# EAGLE design Macro Keyboard 32u4 RC SK6812_LED Ver2.1 (EAGLE 9.6.2)
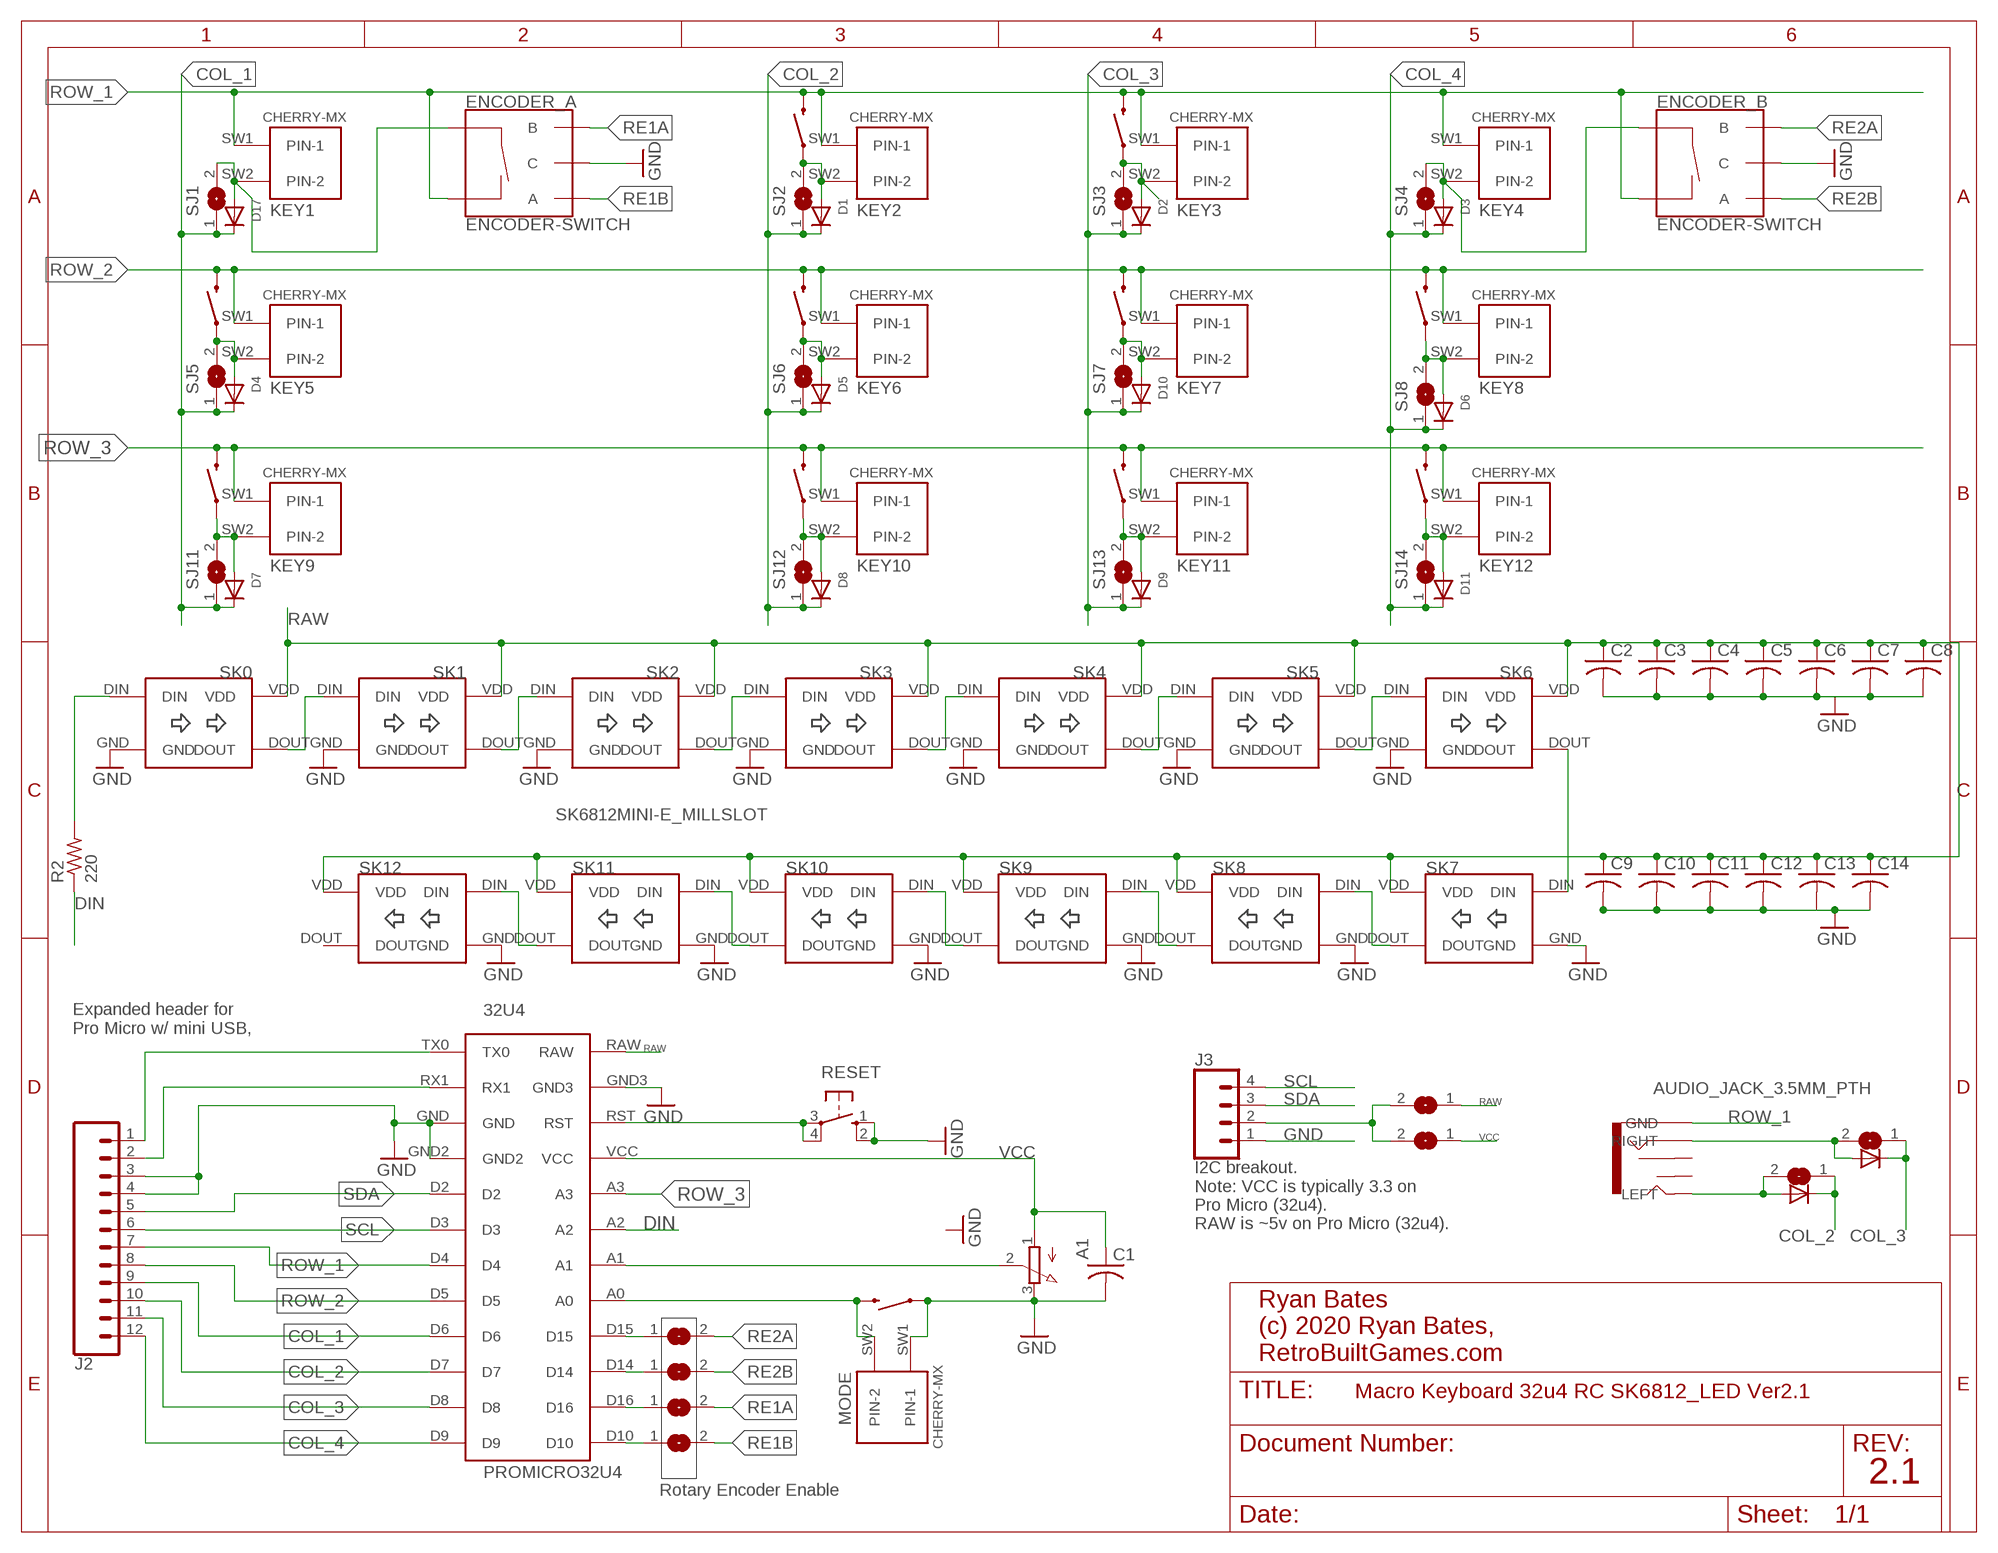
[diagram p0: schematic, sheet 1]

## Parts
32U4  PROMICRO32U4  [PROMICRO32U4]
A1  3RP/1610N  [3RP/1610N]
C1  C-USC1206  [C1206]
C2  C-USC0805K  [C0805K]
C3  C-USC0805K  [C0805K]
C4  C-USC0805K  [C0805K]
C5  C-USC0805K  [C0805K]
C6  C-USC0805K  [C0805K]
C7  C-USC0805K  [C0805K]
C8  C-USC0805K  [C0805K]
C9  C-USC0805K  [C0805K]
C10  C-USC0805K  [C0805K]
C11  C-USC0805K  [C0805K]
C12  C-USC0805K  [C0805K]
C13  C-USC0805K  [C0805K]
C14  C-USC0805K  [C0805K]
D1  DIODESOD-123  [SOD-123]
D2  DIODESOD-123  [SOD-123]
D3  DIODESOD-123  [SOD-123]
D4  DIODESOD-123  [SOD-123]
D5  DIODESOD-123  [SOD-123]
D6  DIODESOD-123  [SOD-123]
D7  DIODESOD-123  [SOD-123]
D8  DIODESOD-123  [SOD-123]
D9  DIODESOD-123  [SOD-123]
D10  DIODESOD-123  [SOD-123]
D11  DIODESOD-123  [SOD-123]
D15  DIODESOD-123  [SOD-123]
D16  DIODESOD-123  [SOD-123]
D17  DIODESOD-123  [SOD-123]
ENCODER_A  ENCODER-SWITCH  [ROTARY_ENC_PLAIN]
ENCODER_B  ENCODER-SWITCH  [ROTARY_ENC_PLAIN]
J1  AUDIO_JACK_3.5MM_PTH  [AUDIO-JACK]
J2  CONN_12NO_SILK  [1X12_NO_SILK]
J3  CONN_041X04_NO_SILK  [1X04_NO_SILK]
KEY1  CHERRY-MX  [CHERRY-MX]
KEY2  CHERRY-MX  [CHERRY-MX]
KEY3  CHERRY-MX  [CHERRY-MX]
KEY4  CHERRY-MX  [CHERRY-MX]
KEY5  CHERRY-MX  [CHERRY-MX]
KEY6  CHERRY-MX  [CHERRY-MX]
KEY7  CHERRY-MX  [CHERRY-MX]
KEY8  CHERRY-MX  [CHERRY-MX]
KEY9  CHERRY-MX  [CHERRY-MX]
KEY10  CHERRY-MX  [CHERRY-MX]
KEY11  CHERRY-MX  [CHERRY-MX]
KEY12  CHERRY-MX  [CHERRY-MX]
MODE  CHERRY-MX  [CHERRY-MX]
R2  220  R-US_M1206  [M1206]
RESET  10-XX  [B3F-10XX]
S1  MOMENTARY-SWITCH-SPST-PTH-12MM  [TACTILE_SWITCH_PTH_12MM]
S2  MOMENTARY-SWITCH-SPST-PTH-12MM  [TACTILE_SWITCH_PTH_12MM]
S3  MOMENTARY-SWITCH-SPST-PTH-12MM  [TACTILE_SWITCH_PTH_12MM]
S4  MOMENTARY-SWITCH-SPST-PTH-12MM  [TACTILE_SWITCH_PTH_12MM]
S5  MOMENTARY-SWITCH-SPST-PTH-12MM  [TACTILE_SWITCH_PTH_12MM]
S6  MOMENTARY-SWITCH-SPST-PTH-12MM  [TACTILE_SWITCH_PTH_12MM]
S7  MOMENTARY-SWITCH-SPST-PTH-12MM  [TACTILE_SWITCH_PTH_12MM]
S8  MOMENTARY-SWITCH-SPST-PTH-12MM  [TACTILE_SWITCH_PTH_12MM]
S9  MOMENTARY-SWITCH-SPST-PTH-12MM  [TACTILE_SWITCH_PTH_12MM]
S10  MOMENTARY-SWITCH-SPST-PTH-12MM  [TACTILE_SWITCH_PTH_12MM]
S11  MOMENTARY-SWITCH-SPST-PTH-12MM  [TACTILE_SWITCH_PTH_12MM]
SJ1  SJ  [SJ]
SJ2  SJ  [SJ]
SJ3  SJ  [SJ]
SJ4  SJ  [SJ]
SJ5  SJ  [SJ]
SJ6  SJ  [SJ]
SJ7  SJ  [SJ]
SJ8  SJ  [SJ]
SJ9  SJ  [SJ]
SJ10  SJ  [SJ]
SJ11  SJ  [SJ]
SJ12  SJ  [SJ]
SJ13  SJ  [SJ]
SJ14  SJ  [SJ]
SJ16  SJ  [SJ]
SJ17  SJ  [SJ]
SJ18  SJ  [SJ]
SJ19  SJ  [SJ]
SJ20  SJ  [SJ]
SJ21  SJ  [SJ]
SK0  SK6812MINI-E_MILLSLOT  [SK6812MINI-E_MILLSLOT]
SK1  SK6812MINI-E_MILLSLOT  [SK6812MINI-E_MILLSLOT]
SK2  SK6812MINI-E_MILLSLOT  [SK6812MINI-E_MILLSLOT]
SK3  SK6812MINI-E_MILLSLOT  [SK6812MINI-E_MILLSLOT]
SK4  SK6812MINI-E_MILLSLOT  [SK6812MINI-E_MILLSLOT]
SK5  SK6812MINI-E_MILLSLOT  [SK6812MINI-E_MILLSLOT]
SK6  SK6812MINI-E_MILLSLOT  [SK6812MINI-E_MILLSLOT]
SK7  SK6812MINI-E_MILLSLOT  [SK6812MINI-E_MILLSLOT]
SK8  SK6812MINI-E_MILLSLOT  [SK6812MINI-E_MILLSLOT]
SK9  SK6812MINI-E_MILLSLOT  [SK6812MINI-E_MILLSLOT]
SK10  SK6812MINI-E_MILLSLOT  [SK6812MINI-E_MILLSLOT]
SK11  SK6812MINI-E_MILLSLOT  [SK6812MINI-E_MILLSLOT]
SK12  SK6812MINI-E_MILLSLOT  [SK6812MINI-E_MILLSLOT]

## Nets
COL_1: 32U4.D6 D4.C D7.C D17.C J2.9 SJ1.1 SJ5.1 SJ11.1
COL_2: 32U4.D7 D1.C D5.C D8.C D15.C J2.10 SJ2.1 SJ6.1 SJ12.1 SJ16.1
COL_3: 32U4.D8 D2.C D9.C D10.C D16.C J2.11 SJ3.1 SJ7.1 SJ13.1 SJ17.1
COL_4: 32U4.D9 D3.C D6.C D11.C J2.12 SJ4.1 SJ8.1 SJ14.1
DIN: 32U4.A2 R2.1
GND: 32U4.GND 32U4.GND2 32U4.GND3 A1.3(E) C1.2 C2.2 C3.2 C4.2 C5.2 C6.2 C7.2 C8.2 C9.2 C10.2 C11.2 C12.2 C13.2 C14.2 ENCODER_A.C ENCODER_B.C J2.3 J2.4 J3.1 MODE.SW1(PIN-1) RESET.1(S) RESET.2(S1) S11.1 SK0.GND SK1.GND SK2.GND SK3.GND SK4.GND SK5.GND SK6.GND SK7.GND SK8.GND SK9.GND SK10.GND SK11.GND SK12.GND
N$1: 32U4.RX1 J2.2
N$2: D1.A KEY2.SW2(PIN-2) S4.1 SJ2.2
N$3: D4.A KEY5.SW2(PIN-2) S9.1 SJ5.2
N$4: D5.A KEY6.SW2(PIN-2) S10.1 SJ6.2
N$6: SK0.DOUT SK1.DIN
N$7: D3.A ENCODER_B.SW+ KEY4.SW2(PIN-2) SJ4.2
N$8: D2.A KEY3.SW2(PIN-2) S3.1 SJ3.2
N$9: D16.A J1.RIGHT SJ17.2
N$10: 32U4.RST RESET.3(P) RESET.4(P1)
N$11: 32U4.TX0 J2.1
N$12: 32U4.A0 MODE.SW2(PIN-2) S11.3
N$13: SK1.DOUT SK2.DIN
N$14: SK2.DOUT SK3.DIN
N$15: D10.A KEY7.SW2(PIN-2) S1.1 SJ7.2
N$17: R2.2 SK0.DIN
N$19: D6.A KEY8.SW2(PIN-2) S2.1 SJ8.2
N$20: D17.A ENCODER_A.SW+ KEY1.SW2(PIN-2) SJ1.2
N$21: SK3.DOUT SK4.DIN
N$23: J3.2 SJ9.2 SJ10.2
N$24: D7.A KEY9.SW2(PIN-2) S5.1 SJ11.2
N$25: 32U4.A1 A1.2(S)
N$26: D9.A KEY11.SW2(PIN-2) S7.1 SJ13.2
N$27: D8.A KEY10.SW2(PIN-2) S6.1 SJ12.2
N$28: D11.A KEY12.SW2(PIN-2) S8.1 SJ14.2
N$29: SK4.DOUT SK5.DIN
N$30: SK5.DOUT SK6.DIN
N$31: SK6.DOUT SK7.DIN
N$32: SK7.DOUT SK8.DIN
N$33: SK8.DOUT SK9.DIN
N$34: SK9.DOUT SK10.DIN
N$35: 32U4.D15 SJ18.1
N$36: 32U4.D14 SJ19.1
N$37: 32U4.D16 SJ20.1
N$38: 32U4.D10 SJ21.1
N$39: SK10.DOUT SK11.DIN
N$40: SK11.DOUT SK12.DIN
N$41: D15.A J1.LEFT SJ16.2
RAW: 32U4.RAW C2.1 C3.1 C4.1 C5.1 C6.1 C7.1 C8.1 C9.1 C10.1 C11.1 C12.1 C13.1 C14.1 SJ9.1 SK0.VDD SK1.VDD SK2.VDD SK3.VDD SK4.VDD SK5.VDD SK6.VDD SK7.VDD SK8.VDD SK9.VDD SK10.VDD SK11.VDD SK12.VDD
RE1A: ENCODER_A.B SJ20.2
RE1B: ENCODER_A.A SJ21.2
RE2A: ENCODER_B.B SJ18.2
RE2B: ENCODER_B.A SJ19.2
ROW_1: 32U4.D4 ENCODER_A.SW- ENCODER_B.SW- J1.GND J2.7 KEY1.SW1(PIN-1) KEY2.SW1(PIN-1) KEY3.SW1(PIN-1) KEY4.SW1(PIN-1) S3.3 S4.3
ROW_2: 32U4.D5 J2.8 KEY5.SW1(PIN-1) KEY6.SW1(PIN-1) KEY7.SW1(PIN-1) KEY8.SW1(PIN-1) S1.3 S2.3 S9.3 S10.3
ROW_3: 32U4.A3 KEY9.SW1(PIN-1) KEY10.SW1(PIN-1) KEY11.SW1(PIN-1) KEY12.SW1(PIN-1) S5.3 S6.3 S7.3 S8.3
SCL: 32U4.D3 J2.6 J3.4
SDA: 32U4.D2 J2.5 J3.3
VCC: 32U4.VCC A1.1(A) C1.1 SJ10.1
Unconnected: J1.RSH J1.TSH SK12.DOUT

## Notes on the sheet
- Expanded header for 
  Pro Micro w/ mini USB,
- I2C breakout. 
  Note: VCC is typically 3.3 on 
  Pro Micro (32u4).
  RAW is ~5v on Pro Micro (32u4).
- Ryan Bates 
  (c) 2020 Ryan Bates, 
  RetroBuiltGames.com
- 2.1
- Rotary Encoder Enable

## Library data of the parts
32U4 = Pro-micro32u4:PROMICRO32U4
A1 = pot:3RP/1610N: 16mm Potentiometer one level Source: http://www.alphapotentiometers.net/html/16mm_pot_2.html
C1-C14 = adafruit:C-US: CAPACITOR, American symbol
D1-D11 D15-D17 = adafruit:DIODE: Diode SMADIODE - SMA Surface Mount Package 20V 1A Schottky Diode Digikey: 641-1014-6-ND DO-1N4148 - Through Hole Small Current Diode SOD-123 20V 1 A (.5mV Vf) Schottky Diode - Digikey: MBRX120TPMSCT-ND SOD-323 10V 570mA (.38mV Vf, 3ns) Schottky Diode - Digikey: ZLLS410CT-ND SOD-523 30V 30mA Schottky Diode (RB751S-40TE61) - Digikey: RB751S-40TE61CT-ND SOT23-R/W - SOT23 Package (R = Solder Paste/Reflow Ovens, W = Hand-Soldering) BAT54Film 40V 300mA - Digikey: 497-7162-1-ND
ENCODER_A ENCODER_B = SparkFun-Switches_ryan_edits:ENCODER-SWITCH: Rotary Encoder w/ Select Switch Encoders rotate similarly to potentiometers, but they’re different from potentiometers in that an encoder has full rotation without limits. They output gray code so that you can tell how much and in which direction the encoder has been turned. This encoder includes a push-down select switch built into the shaft. SparkFun Products Rotary Encoder <https://www.sparkfun.com/products/9117> (COM-09117); SF_SKU: COM-09117
J1 = SparkFun-Connectors:AUDIO_JACK_3.5MM: Audio Jack 3.5mm variants of PTH and SMT stereo audio jack with bypass switches. SparkFun Products: SparkFun SparkPunk Sound Kit <[https://www.sparkfun.com/products/11177]> - PTH MP3 Trigger <https://www.sparkfun.com/products/13720> -3.5mm SMD SparkFun PicoBoard <https://www.sparkfun.com/products/11888>- 2.5mm SMD; PROD_ID: CONN-08774; SF_ID: PRT-08032
J2 = SparkFun-Connectors:CONN_12: Multi connection point. Often used as Generic Header-pin footprint for 0.1 inch spaced/style header connections On any of the 0.1 inch spaced packages, you can populate with these: Break Away Headers - Straight <https://www.sparkfun.com/products/116> (PRT-00116) Break Away Male Headers - Right Angle <https://www.sparkfun.com/products/553> (PRT-00553) Female Headers <https://www.sparkfun.com/products/115> (PRT-00115) Break Away Headers - Machine Pin <https://www.sparkfun.com/products/117> (PRT-00117) Break Away Female Headers - Swiss Machine Pin <https://www.sparkfun.com/products/743> (PRT-00743) For SCREWTERMINALS and SPRING TERMINALS visit here: Screw Terimnals on SparkFun.com <https://www.sparkfun.com/search/results?term=Screw+Terminals> (5mm/3.5mm/2.54mm spacing) This device is also useful as a general connection point to wire up your design to another part of your project. Our various solder wires solder well into these plated through hole pads. Hook-Up Wire - Assortment (Stranded, 22 AWG) <https://www.sparkfun.com/products/11375> (PRT-11375) Hook-Up Wire - Assortment (Solid Core, 22 AWG) <https://www.sparkfun.com/products/11367> (PRT-11367) View the entire wire category on our website here <https://www.sparkfun.com/categories/141> Special notes: Molex polarized connector foot print use with SKU : PRT-08231 with associated crimp pins and housings. 1MM SMD Version SKU: PRT-10208 NOTES ON THE VARIANTS LOCK and LOCK_LONGPADS... This footprint was designed to help hold the alignment of a through-hole component (i.e. 6-pin header) while soldering it into place. You may notice that each hole has been shifted either up or down by 0.005 of an inch from it's more standard position (which is a perfectly straight line). This slight alteration caused the pins (the squares in the middle) to touch the edges of the holes. Because they are alternating, it causes a "brace" to hold the component in place. 0.005 has proven to be the perfect amount of "off-center" position when using our standard breakaway headers. Although looks a little odd when you look at the bare footprint, once you have a header in there, the alteration is very hard to notice. Also,if you push a header all the way into place, it is covered up entirely on the bottom side.
J3 = SparkFun-Connectors:CONN_04: Multi connection point. Often used as Generic Header-pin footprint for 0.1 inch spaced/style header connections On any of the 0.1 inch spaced packages, you can populate with these: Break Away Headers - Straight <https://www.sparkfun.com/products/116> (PRT-00116) Break Away Male Headers - Right Angle <https://www.sparkfun.com/products/553> (PRT-00553) Female Headers <https://www.sparkfun.com/products/115> (PRT-00115) Break Away Headers - Machine Pin <https://www.sparkfun.com/products/117> (PRT-00117) Break Away Female Headers - Swiss Machine Pin <https://www.sparkfun.com/products/743> (PRT-00743) For SCREWTERMINALS and SPRING TERMINALS visit here: Screw Terimnals on SparkFun.com <https://www.sparkfun.com/search/results?term=Screw+Terminals> (5mm/3.5mm/2.54mm spacing) This device is also useful as a general connection point to wire up your design to another part of your project. Our various solder wires solder well into these plated through hole pads. Hook-Up Wire - Assortment (Stranded, 22 AWG) <https://www.sparkfun.com/products/11375> (PRT-11375) Hook-Up Wire - Assortment (Solid Core, 22 AWG) <https://www.sparkfun.com/products/11367> (PRT-11367) View the entire wire category on our website here <https://www.sparkfun.com/categories/141> Special notes: Molex polarized connector foot print use with SKU : PRT-08231 with associated crimp pins and housings. 1MM SMD Version SKU: PRT-10208; PROD_ID: CONN-09696
KEY1-KEY12 MODE = cherrymx:CHERRY-MX: Cherry MX series keyswitch
R2 = adafruit:R-US_: RESISTOR, American symbol
RESET = switch-omron:10-XX: OMRON SWITCH; MPN: B3F-1000; OC_FARNELL: 176432; OC_NEWARK: 36M3542
S1-S11 = SparkFun-Switches:MOMENTARY-SWITCH-SPST: Momentary Switch (Pushbutton) - SPST Normally-open (NO) SPST momentary switches (buttons, pushbuttons). Variants PTH-12MM - 12mm square, through-hole Momentary Pushbutton Switch - 12mm Square <https://www.sparkfun.com/products/9190> (COM-09190) PTH-6.0MM, PTH-6.0MM-KIT - 6.0mm square, through-hole Mini Pushbutton Switch <https://www.sparkfun.com/products/97> (COM-00097) KIT package intended for soldering kit's - only one side of pads' copper is exposed. PTH-RIGHT-ANGLE-KIT - Right-angle, through-hole Right Angle Tactile Button <https://www.sparkfun.com/products/10791> - Used on SparkFun BigTime Watch Kit <https://www.sparkfun.com/products/11734> SMD-12MM - 12mm square, surface-mount Tactile Button - SMD (12mm) <https://www.sparkfun.com/products/12993> (COM-12993) Used on SparkFun PicoBoard <https://www.sparkfun.com/products/11888> SMD-4.5MM - 4.5mm Square Trackball Switch Used on SparkFun Blackberry Trackballer Breakout <https://www.sparkfun.com/products/13169> SMD-4.6MMX2.8MM - 4.60mm x 2.80mm, surface mount Used on SparkFun SAMD21 Mini Breakout <https://www.sparkfun.com/products/13664> SMD-5.2MM, SMD-5.2-REDUNDANT - 5.2mm square, surface-mount Mini Pushbutton Switch - SMD <https://www.sparkfun.com/products/8720> (COM-08720) Used on Arduino Pro Mini <https://www.sparkfun.com/products/11114> REDUNDANT package connects both switch circuits together SMD-6.0X3.5MM - 6.0 x 3.5mm, surface mount Momentary Reset Switch SMD <https://www.sparkfun.com/products/8229> (COM-08229) SMD-6.2MM-TALL - 6.2mm square, surface mount Tactile Button - SMD (6mm) <https://www.sparkfun.com/products/12992> Used on SparkFun Digital Sandbox <https://www.sparkfun.com/products/12651> SMD-RIGHT-ANGLE - Right-angle, surface mount Used on SparkFun Block for Intel® Edison - Arduino <https://www.sparkfun.com/products/13036>; PROD_ID: SWCH-09185; SF_SKU: COM-09190
SJ1-SJ14 SJ16-SJ21 = jumper:SJ: SMD solder JUMPER
SK0 SK1-SK12 = SK6812MINI-E_addressable_LED:SK6812MINI-E_MILLSLOT

## Net classes
0 vcc: width 0.254 mm, clearance 0.127 mm

## Board
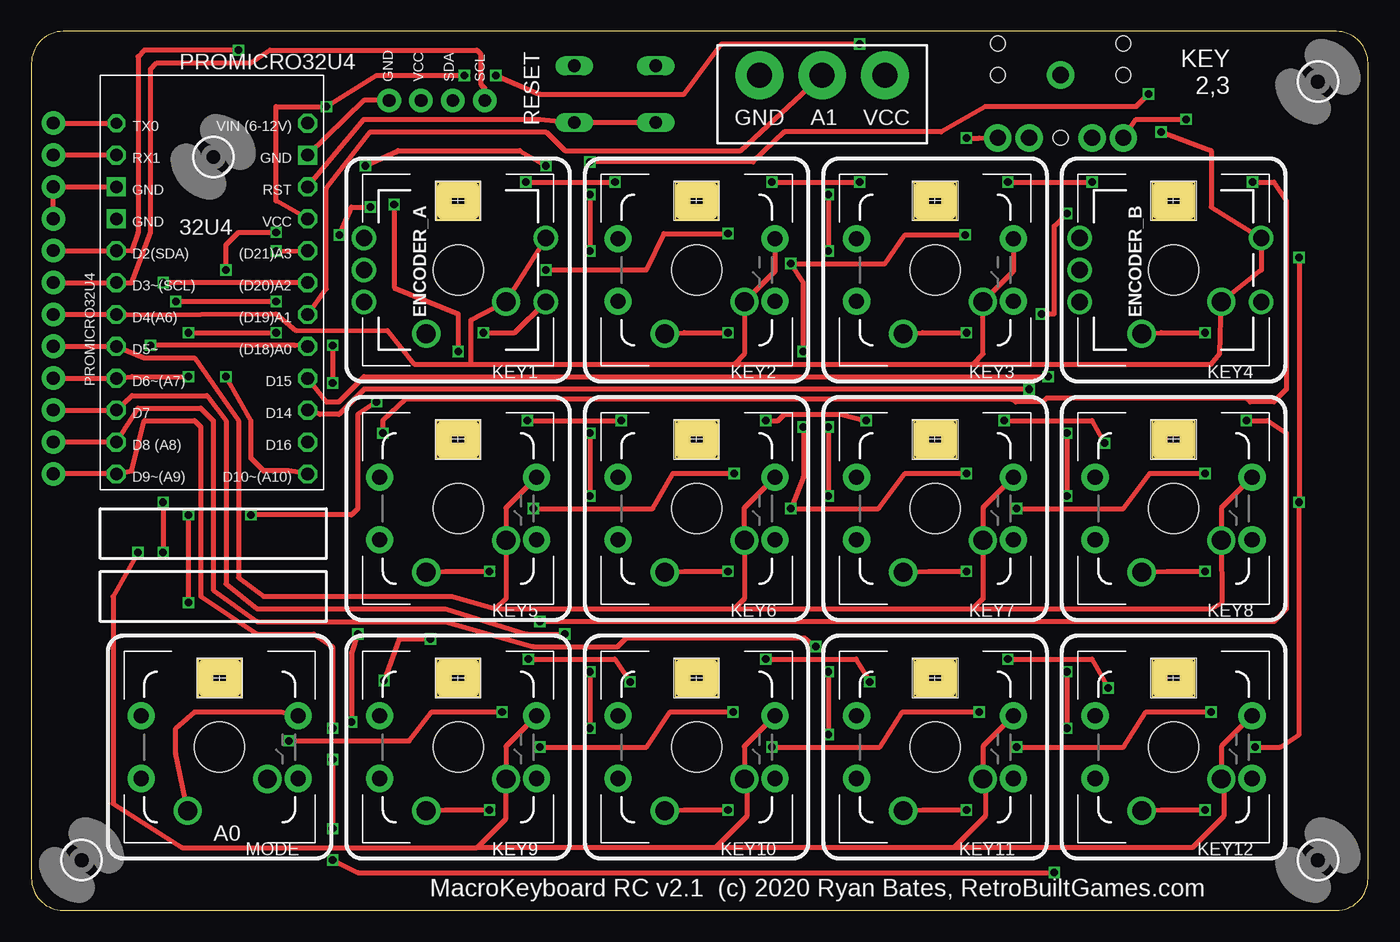
[diagram p1: board, top side]
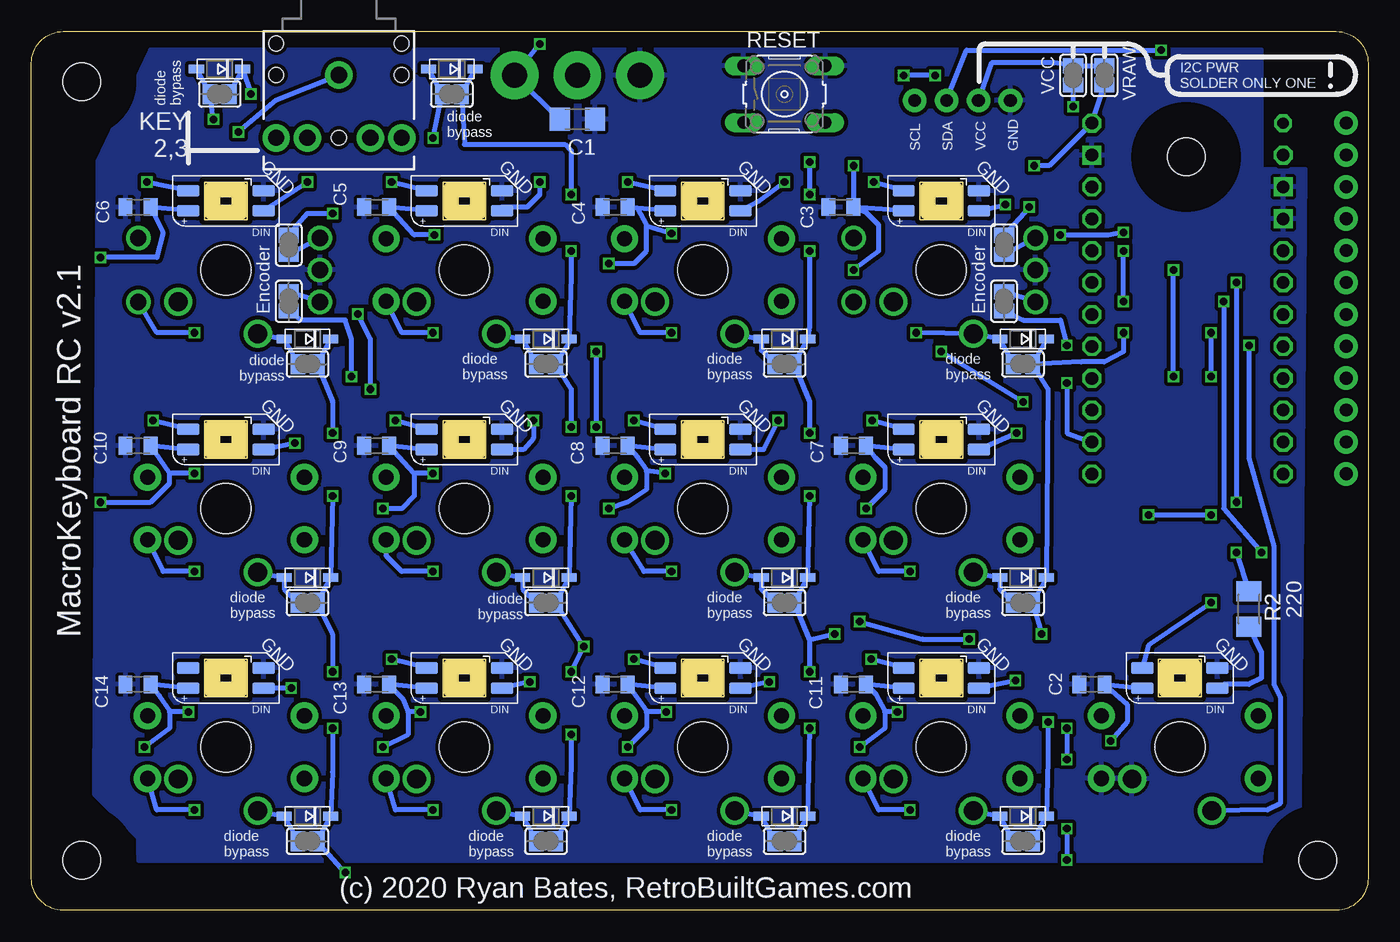
[diagram p2: board, bottom side, seen from below]

Size 106.5 x 70 mm. Coordinates in mm from the lower left corner, seen from the top.
Outline: 0,67.46 0,2.54 arc90 2.54,0 103.96,0 arc90 106.5,2.54 106.5,67.46 arc90 103.96,70 2.54,70 arc90 0,67.46
Copper layers (1*16): Top 0.035mm / dielectric 1.5mm / Bottom 0.035mm
Design rules "SeeedStudio_2layer_DRU_no_angle_20140221": minimum track width 6mil, minimum drill 12mil, track to track 6mil, track to pad 6mil, pad to pad 6mil, via to via 6mil, smd to smd 0mil, copper to edge 10mil, drill to drill 10mil, minimum pad ring 10mil, minimum via ring 6mil, stop-mask expansion 2mil, vias tented up to drill 100mil, thermal gap 10mil

### Footprints (pad centres in the part's own frame; a part is rotated, then mirrored left to right if it is on the bottom)
PROMICRO32U4 = drill 1 octagon: A0 16.51,-21.59; A1 16.51,-19.05; A2 16.51,-16.51; A3 16.51,-13.97; D2 1.27,-13.97; D3 1.27,-16.51; D4 1.27,-19.05; D5 1.27,-21.59; D6 1.27,-24.13; D7 1.27,-26.67; D8 1.27,-29.21; D9 1.27,-31.75; D10 16.51,-31.75; D14 16.51,-26.67; D15 16.51,-24.13; D16 16.51,-29.21; RAW 16.51,-3.81; RST 16.51,-8.89; RX1 1.27,-6.35; VCC 16.51,-11.43 | drill 1 square: GND 1.27,-8.89; GND2 1.27,-11.43; GND3 16.51,-6.35 | drill 0.9 octagon: TX0 1.27,-3.81
3RP/1610N = drill 2 pad 3.81: 1 -5,0; 2 0,0; 3 5,0
C1206 = smd 1.6 x 1.8: 1 -1.4,0; 2 1.4,0
C0805K = smd 1.1 x 1.4: 1 -1,0; 2 1,0
SOD-123 = smd 1.2 x 0.7: A 1.85,0; C -1.85,0
ROTARY_ENC_PLAIN = drill 1.3: A 7.493,-2.54; B 7.493,2.54; C 7.493,0; SW+ -6.985,2.54; SW- -6.985,-2.54
AUDIO-JACK = drill 1.3 pad 2.184: GND 0,0; LEFT 5,-5; RIGHT 5,5; RSH 5,2.5; TSH 5,-2.5 | hole 1.2: 0,5; -2.5,5; -2.5,-5; 0,-5; 5,0
1X12_NO_SILK = drill 1.016 pad 1.88: 1 0,0; 2 2.54,0; 3 5.08,0; 4 7.62,0; 5 10.16,0; 6 12.7,0; 7 15.24,0; 8 17.78,0; 9 20.32,0; 10 22.86,0; 11 25.4,0; 12 27.94,0
1X04_NO_SILK = drill 1.016 pad 1.88: 1 0,0; 2 2.54,0; 3 5.08,0; 4 7.62,0
CHERRY-MX = drill 1.5 pad 2.184: SW1 -3.81,2.54; SW2 2.54,5.08 | hole 4: 0,0
M1206 = smd 1.6 x 2: 1 -1.4,0; 2 1.4,0
B3F-10XX = drill 1.016 long: 1 -3.251,2.261; 2 3.251,2.261; 3 -3.251,-2.261; 4 3.251,-2.261
TACTILE_SWITCH_PTH_12MM = drill 1.2 pad 2.159: 1 6.25,-2.5; 2 -6.25,-2.5; 3 6.25,2.5; 4 -6.25,2.5
SJ = smd 1.168 x 1.6: 1 -0.762,0; 2 0.762,0
SK6812MINI-E_MILLSLOT = smd 1.778 x 0.914 bottom: DIN 3,0.8; DOUT -3,-0.8; GND 3,-0.8; VDD -3,0.8
3,0 = hole 3: 0,0

### Placement (x,y rotation side)
32U4  5.5,66.5 0 top
A1  63,66.5 180 top
C1  63,63 0 bottom
C2  22,18 180 bottom
C3  42,56 180 bottom
C4  60,56 180 bottom
C5  79,56 180 bottom
C6  98,56 180 bottom
C7  41,37 180 bottom
C8  60,37 180 bottom
C9  79,37 180 bottom
C10  98,37 180 bottom
C11  41,18 180 bottom
C12  60,18 180 bottom
C13  79,18 180 bottom
C14  98,18 180 bottom
D1  46.5,45.5 180 bottom
D2  65.5,45.5 180 bottom
D3  84.5,45.5 180 bottom
D4  27.5,26.5 180 bottom
D5  46.5,26.5 180 bottom
D6  84.5,26.5 180 bottom
D7  27.5,7.5 180 bottom
D8  46.5,7.5 180 bottom
D9  65.5,7.5 180 bottom
D10  65.5,26.5 180 bottom
D11  84.5,7.5 180 bottom
D15  91.5,67 180 bottom
D16  73,67 180 bottom
D17  27.5,45.5 180 bottom
ENCODER_A  34,51 180 top
ENCODER_B  91,51 180 top
J1  82,66.53 270 bottom
J2  1.75,62.7 270 top
J3  28.5,64.5 0 top
KEY1  34,51 180 top
KEY2  53,51 180 top
KEY3  72,51 180 top
KEY4  91,51 180 top
KEY5  34,32 180 top
KEY6  53,32 180 top
KEY7  72,32 180 top
KEY8  91,32 180 top
KEY9  34,13 180 top
KEY10  53,13 180 top
KEY11  72,13 180 top
KEY12  91,13 180 top
MODE  15,13 180 top
R2  9.5,24 270 bottom
RESET  46.5,65 0 bottom
S1  72,32 0 top
S2  91,32 0 top
S3  72,51 0 top
S4  53,51 0 top
S5  34,13 0 top
S6  53,13 0 top
S7  72,13 0 top
S8  91,13 0 top
S9  34,32 0 top
S10  53,32 0 top
S11  15,13 0 top
SJ1  27.5,43.5 180 bottom
SJ2  46.5,43.5 180 bottom
SJ3  65.5,43.5 180 bottom
SJ4  84.5,43.5 180 bottom
SJ5  27.5,24.5 180 bottom
SJ6  46.5,24.5 180 bottom
SJ7  65.5,24.5 180 bottom
SJ8  84.5,24.5 180 bottom
SJ9  21,66.5 90 bottom
SJ10  23.5,66.5 90 bottom
SJ11  27.5,5.5 180 bottom
SJ12  46.5,5.5 180 bottom
SJ13  65.5,5.5 180 bottom
SJ14  84.5,5.5 180 bottom
SJ16  91.5,65 180 bottom
SJ17  73,65 180 bottom
SJ18  86,48.5 90 bottom
SJ19  86,53 270 bottom
SJ20  29,48.5 90 bottom
SJ21  29,53 270 bottom
SK0  15,18.5 180 top
SK1  34,56.5 180 top
SK2  53,56.5 180 top
SK3  72,56.5 180 top
SK4  91,56.5 180 top
SK5  34,37.5 180 top
SK6  53,37.5 180 top
SK7  72,37.5 180 top
SK8  91,37.5 180 top
SK9  34,18.5 180 top
SK10  53,18.5 180 top
SK11  72,18.5 180 top
SK12  91,18.5 180 top
U$1  [3,0]  14.5,60 0 top
U$2  [3,0]  102.5,4 0 top
U$7  [3,0]  4,4 0 top
U$8  [3,0]  102.5,66 0 top

### Tracks (layer width: path | path; a pad name or v marks a point on that pad's centre or on a via)
COL_1  (via drill 0.6)
  Top 0.305: 32U4.D6
  Top 0.406: J2.9 32U4.D6 | 32U4.D6 8,42.5 v12.5,42.5 | v26,22 25.5,20.5 v25.5,15 | v12.5,46 v19.5,46
  Bottom 0.406: SJ11.1 D7.C 25.5,12 v25.5,15 | D17.C SJ1.1 | SJ1.1 25.5,41.5 D4.C SJ5.1 v26,22 | SJ1.1 22.85,43.67 21.02,43.67 19.5,44.5 v19.5,46 | v12.5,42.5 v12.5,46
COL_2  (via drill 0.6)
  Top 0.305: 32U4.D7
  Top 0.406: J2.10 32U4.D7 | 32U4.D7 8,41 14,41 15.5,39 15.5,26 18,24 33,24 39.5,22 v42.5,22 | v44.5,19 v44.5,14.5 | v44.5,38 v44.5,33 | v89,65 88,64 76,64 72.5,62 60,62 57.5,59.6 v44.5,59.6 | v44.5,57 v44.5,52.5
  Bottom 0.406: SJ12.1 D8.C v44.5,14.5 | 44.5,21.5 SJ6.1 D5.C v44.5,33 | v42.5,22 44.5,21.5 | 44.5,21.5 v44.5,19 | v44.5,38 44.5,40.5 SJ2.1 D1.C 44.5,46.5 v44.5,52.5 | SJ16.1 D15.C v89,65 | v44.5,59.6 v44.5,57
COL_3  (via drill 0.6)
  Top 0.305: 32U4.D8
  Top 0.406: J2.11 32U4.D8 | 32U4.D8 8.5,40 13.5,40 14.5,39 14.5,25.5 18,23 33,23 40,21 46.7,21 47.4,21.7 61.6,21.7 v62.5,21 | v63.5,19 v63.5,14 | v63.5,38.5 v63.5,33 | v63.5,57 v63.5,52.5
  Bottom 0.406: SJ13.1 D9.C 63.5,11.5 v63.5,14 | v63.5,19 v62.5,21 SJ7.1 D10.C v63.5,33 | v63.5,38.5 63.5,41.5 SJ3.1 63.5,45.5 D2.C 63.5,50.5 v63.5,52.5 | D16.C SJ17.1 72,61 64,61 63.5,60.5 v63.5,57
COL_4  (via drill 0.6)
  Top 0.305: J2.12
  Top 0.406: J2.12 32U4.D9 8,35 9,39 13,39 13.5,38.5 13.5,25 18,22 22.5,22 24,21 v24,14.5 | v24,12 v24,6.5 | v24,4 26,3 v81.5,3 | v82.5,19 v82.5,14.5 | v82.5,38 v82.5,33
  Bottom 0.406: D3.C SJ4.1 82.5,40.5 v82.5,38 | v24,14.5 v24,12 | v24,6.5 v24,4 | v81.5,3 SJ14.1 D11.C 82.5,11 v82.5,14.5 | v82.5,19 82.5,22 SJ8.1 D6.C v82.5,33
DIN  (via drill 0.6)
  Top 0.406: 32U4.A2 19,50 v10.5,50 | v10.5,32.5 v10.5,28.5
  Bottom 0.406: v10.5,50 v10.5,32.5 | v10.5,28.5 R2.1
GND
  Top 0.406: J2.4 J2.3 32U4.GND | J3.1 26.5,64.5 32U4.GND3
  pour Bottom (isolate 0.305): 8.5,68.5 97,68.5 101.2,59.6 101.5,9.3 98,5.8 98,4 5.5,4 5,59 8.5,59
N$1
  Top 0.305: 32U4.RX1
  Top 0.406: J2.2 32U4.RX1
N$2  (via drill 0.6)
  Top 0.406: KEY2.SW2 52,46 v55.5,46
  Bottom 0.406: SJ2.2 48.35,44.59 D1.A KEY2.SW2 | v55.5,46 58,46 S4.1
N$3  (via drill 0.6)
  Top 0.406: KEY5.SW2 33,27 v36.5,27
  Bottom 0.406: SJ5.2 29.35,25.59 D4.A KEY5.SW2 | v36.5,27 39,27 S9.1
N$4  (via drill 0.6)
  Top 0.406: KEY6.SW2 52,27 v55.5,27
  Bottom 0.406: SJ6.2 48.35,25.59 D5.A KEY6.SW2 | v55.5,27 57.7,27 S10.1
N$6  (via drill 0.6)
  Top 0.406: v28.9,56.2 28.9,49.6 34,47.5 v34,44.5 | v27.5,40.5 26,39.5 26,32 25.5,31.5 v17.5,31.5 | v12.5,31.5 v12.5,24.5
  Bottom 0.406: SK1.DIN v28.9,56.2 | v34,44.5 v27.5,40.5 | v17.5,31.5 v12.5,31.5 | v12.5,24.5 17.5,21.1 SK0.DOUT
N$7  (via drill 0.6)
  Top 0.406: KEY4.SW2 90,46 v93.5,46
  Bottom 0.406: SJ4.2 D3.A 87.95,45.84 KEY4.SW2 | v93.5,46 96.5,46 ENCODER_B.SW+
N$8  (via drill 0.6)
  Top 0.406: KEY3.SW2 71,46 v74.5,46
  Bottom 0.406: SJ3.2 D2.A KEY3.SW2 | v74.5,46 77,46 S3.1
N$9  (via drill 0.6)
  Top 0.406: v74.5,61.5 75.5,61.5 J1.RIGHT
  Bottom 0.406: D16.A SJ17.2 v74.5,61.5
N$10
  Top 0.406: RESET.3 RESET.4 40.5,63 26.5,63 32U4.RST
N$11
  Top 0.305: 32U4.TX0
  Top 0.406: J2.1 32U4.TX0
N$12  (via drill 0.6)
  Top 0.406: 32U4.A0 21,45 v9.5,45 | MODE.SW2 11.5,12.5 11.5,14.5 13,15.8 19.9,15.8 S11.3
  Bottom 0.406: v9.5,45 9.5,36 7.5,29 7.5,18 7,17 7,8.5 8,8 MODE.SW2
N$13  (via drill 0.6)
  Top 0.406: v39.4,58 v46.5,58
  Bottom 0.406: SK1.DOUT v39.4,58 | v46.5,58 48.5,56.5 SK2.DIN
N$14  (via drill 0.6)
  Top 0.406: v59,58 v66,58
  Bottom 0.406: SK2.DOUT v59,58 | v66,58 66,57 67,56 69,56 SK3.DIN
N$15  (via drill 0.6)
  Top 0.406: KEY7.SW2 71.5,27 v74.5,27
  Bottom 0.406: S1.1 78.25,28.25 77,27 v74.5,27 | SJ7.2 67.35,25.59 D10.A KEY7.SW2
N$17
  Bottom 0.406: R2.2 8.5,20.5 8.5,18.5 9.5,18 11.5,18 SK0.DIN
N$19  (via drill 0.6)
  Top 0.406: KEY8.SW2 90.5,27 v93.5,27
  Bottom 0.406: SJ8.2 86.35,25.59 D6.A KEY8.SW2 | v93.5,27 96,27 S2.1
N$20  (via drill 0.6)
  Top 0.406: v36,46 38.5,46 ENCODER_A.SW+
  Bottom 0.406: SJ1.2 D17.A KEY1.SW2 v36,46
N$21  (via drill 0.6)
  Top 0.406: v77.8,58 v84.5,58
  Bottom 0.406: SK3.DOUT v77.8,58 | v84.5,58 SK4.DIN
N$23
  Bottom 0.406: SJ9.2 SJ10.2 25,67.5 30,67.5 J3.2
N$24  (via drill 0.6)
  Top 0.406: KEY9.SW2 33,8 v36.5,8
  Bottom 0.406: KEY9.SW2 D7.A SJ11.2 | v36.5,8 39,8 S5.1
N$25
  Top 0.406: 32U4.A1 23.5,49.5 23.5,57.5 27,62 41,62 42.5,60.5 56.5,60.5 A1.2
N$26  (via drill 0.6)
  Top 0.406: KEY11.SW2 71,8 v74.5,8
  Bottom 0.406: SJ13.2 D9.A KEY11.SW2 | v74.5,8 77.5,8 S7.1
N$27  (via drill 0.6)
  Top 0.406: KEY10.SW2 52,8 v55.5,8
  Bottom 0.406: KEY10.SW2 D8.A SJ12.2 | v55.5,8 58,8 S6.1
N$28  (via drill 0.6)
  Top 0.406: KEY12.SW2 90,8 v93.5,8
  Bottom 0.406: KEY12.SW2 D11.A SJ14.2 | v93.5,8 96.5,8 S8.1
N$29  (via drill 0.6)
  Top 0.406: v97.3,58 99,58 100,56.5 100,41.5 99,40.5 97.1,40.5 96.8,40.8 80.9,40.8 80.6,40.5 78.4,40.5 78.1,40.7 29.8,40.7 28,39 v28,38
  Bottom 0.406: SK4.DOUT v97.3,58 | v28,38 SK5.DIN
N$30  (via drill 0.6)
  Top 0.406: v39.5,39 v47,39
  Bottom 0.406: SK5.DOUT v39.5,39 | v47,39 48.16,36.7 SK6.DIN
N$31  (via drill 0.6)
  Top 0.406: v58.5,39 59.5,39 60,39.5 64.5,39.5 v66.5,39
  Bottom 0.406: SK6.DOUT v58.5,39 | v66.5,39 66.5,37.6 67.3,36.7 SK7.DIN
N$32  (via drill 0.6)
  Top 0.406: v77.5,39 84.5,39 v85.5,37.2
  Bottom 0.406: SK7.DOUT v77.5,39 | v85.5,37.2 SK8.DIN
N$33  (via drill 0.6)
  Top 0.406: v96.8,39 98.5,39 100,38 100,24 99,23 v40.5,23 | v31.8,21.6 29.3,21.6 v28.1,18.3
  Bottom 0.406: SK8.DOUT v96.8,39 | v40.5,23 35.5,21.6 v31.8,21.6 | v28.1,18.3 SK9.DIN
N$34  (via drill 0.6)
  Top 0.406: v39.6,20 46.5,20 v47.7,18.2
  Bottom 0.406: SK9.DOUT v39.6,20 | v47.7,18.2 SK10.DIN
N$35  (via drill 0.6)
  Top 0.406: 32U4.D15 23.5,40.5 24.5,40.5 26.5,42.5 v81,42.5
  Bottom 0.406: v81,42.5 81,45.5 81.5,47 85,47 SJ18.1
N$36  (via drill 0.6)
  Top 0.406: v79.5,41.5 26.5,41.5 24.5,39.5 23,39.5 32U4.D14 | v82.5,55.5 81.5,54.5 81.5,47.5 v80.5,47.5
  Bottom 0.406: SJ19.1 84.5,55.5 v82.5,55.5 | v79.5,41.5 79.5,45.5 v80.5,47.5
N$37  (via drill 0.6)
  Top 0.406: v24,45 v24,42
  Bottom 0.406: SJ20.1 27.5,47 24.5,47 v24,45 | v24,42 24,38 32U4.D16
N$38  (via drill 0.6)
  Top 0.406: 32U4.D10 20.5,35 18.5,35 17.5,36 17.5,39 v15.5,42.5 | v15.5,51 15.5,53 16.5,54 v19.5,54 | v27,56 25.5,56 v24.55,53.77
  Bottom 0.406: v15.5,42.5 v15.5,51 | v27,56 SJ21.1 | v19.5,54 20.7,53.77 v24.55,53.77
N$39  (via drill 0.6)
  Top 0.406: v58.5,20 65.7,20 v66.8,18.2
  Bottom 0.406: SK10.DOUT v58.5,20 | v66.8,18.2 SK11.DIN
N$40  (via drill 0.6)
  Top 0.406: v77.8,20 84.5,20 v85.8,17.7
  Bottom 0.406: SK11.DOUT v77.8,20 | v85.8,17.7 SK12.DIN
N$41  (via drill 0.6)
  Top 0.406: J1.LEFT 88,63 v92,63
  Bottom 0.406: D15.A SJ16.2 v92,63
RAW  (via drill 0.6)
  Top 0.406: v74.5,34.8 69.6,34.8 67.5,32 v60.5,32 61.5,34.5 v61.5,38.5 | v78.5,32 87,32 89.1,34.8 v93.5,34.8 | v101,52 v101,32.5 101,14 99.5,13 v97.5,13 | v74.4,53.8 69.6,53.8 68,51.5 v60.5,51.5 61.5,50 v61.5,44.5 | v20.5,13.5 30.1,13.5 31.9,15.8 v37.5,15.8 | v40.5,13 49,13 50.9,15.8 v55.9,15.8 | v59,13 67.6,13 69.4,15.8 v75.5,15.8 | v78.5,13 87,13 88.8,15.8 v94,15.8 | v41,51 49,51 50.4,53.9 v55.5,53.9 | v40,32 49.5,32 51.1,34.8 v56,34.8 | v26.6,59.3 29.2,60.5 38.9,60.5 v41,59.3
  Bottom 0.406: SJ9.1 32U4.RAW 25.4,59.3 v26.6,59.3 | SK1.VDD C3.1 | SK2.VDD C4.1 58.2,55.9 57.5,54.6 57.5,54.5 | SK3.VDD C5.1 76,53.8 v74.4,53.8 | SK4.VDD C6.1 96,54 96.5,52 v101,52 | SK5.VDD C7.1 39.3,36.1 38.5,35.3 38.5,33.5 v40,32 | SK6.VDD C8.1 58.2,36.1 57.5,35.1 57.5,35 | SK7.VDD C9.1 76,34.8 | SK8.VDD C10.1 95.5,34.8 | SK12.VDD C14.1 96.3,17.1 95.5,15.9 95.5,15.8 | SK11.VDD C13.1 78.3,18.3 76.9,16.8 76.5,15.8 | SK10.VDD C12.1 57.5,15.9 57.5,15.8 | SK9.VDD C11.1 39.2,17.2 38.5,15.9 38.5,15.8 | 57.5,35 57.5,33.5 59,32.5 v60.5,32 | 57.5,15.8 57.5,14.5 v59,13 | 76,34.8 76,33 77,32 v78.5,32 | v93.5,34.8 95.5,34.8 | v101,32.5 97,32.5 95.5,34 95.5,34.8 | v60.5,51.5 58.5,51.5 57.5,52.5 57.5,54.5 | SK0.VDD C2.1 19.2,16.4 19.2,15 v20.5,13.5 | 38.5,15.8 38.5,14.5 v40.5,13 | 76.5,15.8 76.5,14 v78.5,13 | 95.5,15.8 95.5,14.5 v97.5,13 | v61.5,44.5 v61.5,38.5 | C3.1 40,55.6 39,54.6 39,52.5 v41,51 | v74.5,34.8 76,34.8 | v55.5,53.9 57.5,54.5 | v37.5,15.8 38.5,15.8 | v55.9,15.8 57.5,15.8 | v75.5,15.8 76.5,15.8 | v94,15.8 95.5,15.8 | v56,34.8 57.5,35 | v41,59.3 C3.1
RE1A
  Bottom 0.406: ENCODER_A.B SJ20.2
RE1B
  Bottom 0.406: ENCODER_A.A SJ21.2
RE2A
  Bottom 0.406: ENCODER_B.B SJ18.2
RE2B
  Bottom 0.406: ENCODER_B.A SJ19.2
ROW_1  (via drill 0.6)
  Top 0.305: 32U4.D4
  Top 0.406: J2.7 32U4.D4 | 32U4.D4 7.55,47.45 19.5,47.5 21.1,46.17 28.35,46.19 30.5,43.5 35,43.5 | 35,43.5 56,43.5 | 56,43.5 75,43.5 | 75,43.5 94.03,43.5 94.67,44.33 KEY4.SW1 98,51 ENCODER_B.SW- 94,56 94,60.5 v90,62 | S3.3 78.25,50.9 KEY3.SW1 75.81,44.31 75,43.5 | 56,43.5 56.81,44.31 KEY2.SW1 59.25,50.9 S4.3 | 35,43.5 35,47 KEY1.SW1 ENCODER_A.SW-
  Bottom 0.406: J1.GND 87,64.5 v90,62
ROW_2
  Top 0.305: 32U4.D5
  Top 0.406: J2.8 32U4.D5 9,44 13,44 16.5,39 16.5,26.5 18.5,25 33.5,25 37,24 | 37,24 56,24 | 56,24 75,24 | 75,24 94,24 94.85,24.5 KEY8.SW1 94.81,32.06 S2.3 | S9.3 37.81,32.06 KEY5.SW1 37.81,24.81 37,24 | S10.3 56.81,32.06 KEY6.SW1 56.81,24.81 56,24 | S1.3 75.81,32.06 KEY7.SW1 75.81,24.81 75,24
ROW_3  (via drill 0.6)
  Top 0.406: v8.5,28.5 6.5,25 6.5,8.5 12,5 35.5,5 | 35.5,5 37.81,7.31 KEY9.SW1 37.81,13.06 S5.3 | 54.5,5 57,7.5 57,10.27 KEY10.SW1 56.81,13.06 S6.3 | 54.5,5 35.5,5 | 73.5,5 76,7.5 76,10.27 KEY11.SW1 75.81,13.06 S7.3 | 73.5,5 54.5,5 | 73.5,5 92.5,5 95,7.5 95,10.27 KEY12.SW1 94.81,13.06 S8.3 | v11.5,48.5 v19.5,48.5 | v19.5,52.5 32U4.A3
  Bottom 0.406: v11.5,48.5 11.5,32 v8.5,28.5 | v19.5,48.5 v19.5,52.5
SCL
  Top 0.305: 32U4.D3
  Top 0.406: J2.6 32U4.D3 | 32U4.D3 8,50 9.5,54 9.5,67 10,67.5 17.5,67.5 19,68.5 35.5,68.5 35.8,68.2 35.8,65.8 36.12,65.48 J3.4
SDA  (via drill 0.6)
  Top 0.305: 32U4.D2
  Top 0.406: J2.5 32U4.D2 | v16.5,68.5 9,68.5 8.5,68 8.5,54 8,52.5 32U4.D2
  Bottom 0.406: J3.3 32,68.5 v16.5,68.5
VCC  (via drill 0.6)
  Top 0.406: 32U4.VCC 19.5,56.5 19.5,64 v23.5,64 27.5,66.5 v34.5,66.5 | v37,66.5 40.5,65 52,65 55,69 v66,69
  Bottom 0.406: C1.1 A1.1 v66,69 | v23.5,64 SJ10.1 | v34.5,66.5 v37,66.5

### Text on the board
tPlace: GND / VCC / SDA / SCL | KEY / 2,3 | RESET | GND | VCC | A0 | MacroKeyboard RC v2.1 (c) 2020 Ryan Bates, RetroBuiltGames.com
bPlace: I2C PWR / SOLDER ONLY ONE | VCC | VRAW | diode / bypass | diode / bypass | SCL / SDA / VCC / GND | KEY / 2,3 | MacroKeyboard RC v2.1 | Encoder | Encoder | diode / bypass | diode / bypass | diode / bypass | diode / bypass | diode / bypass | diode / bypass | diode / bypass | diode / bypass | diode / bypass | diode / bypass | diode / bypass | diode / bypass | (c) 2020 Ryan Bates, RetroBuiltGames.com